# Altium schematic sheet Microcontroller.SchDoc: Microcontroller
size A4; SheetNumber: 4; SheetTotal: 13
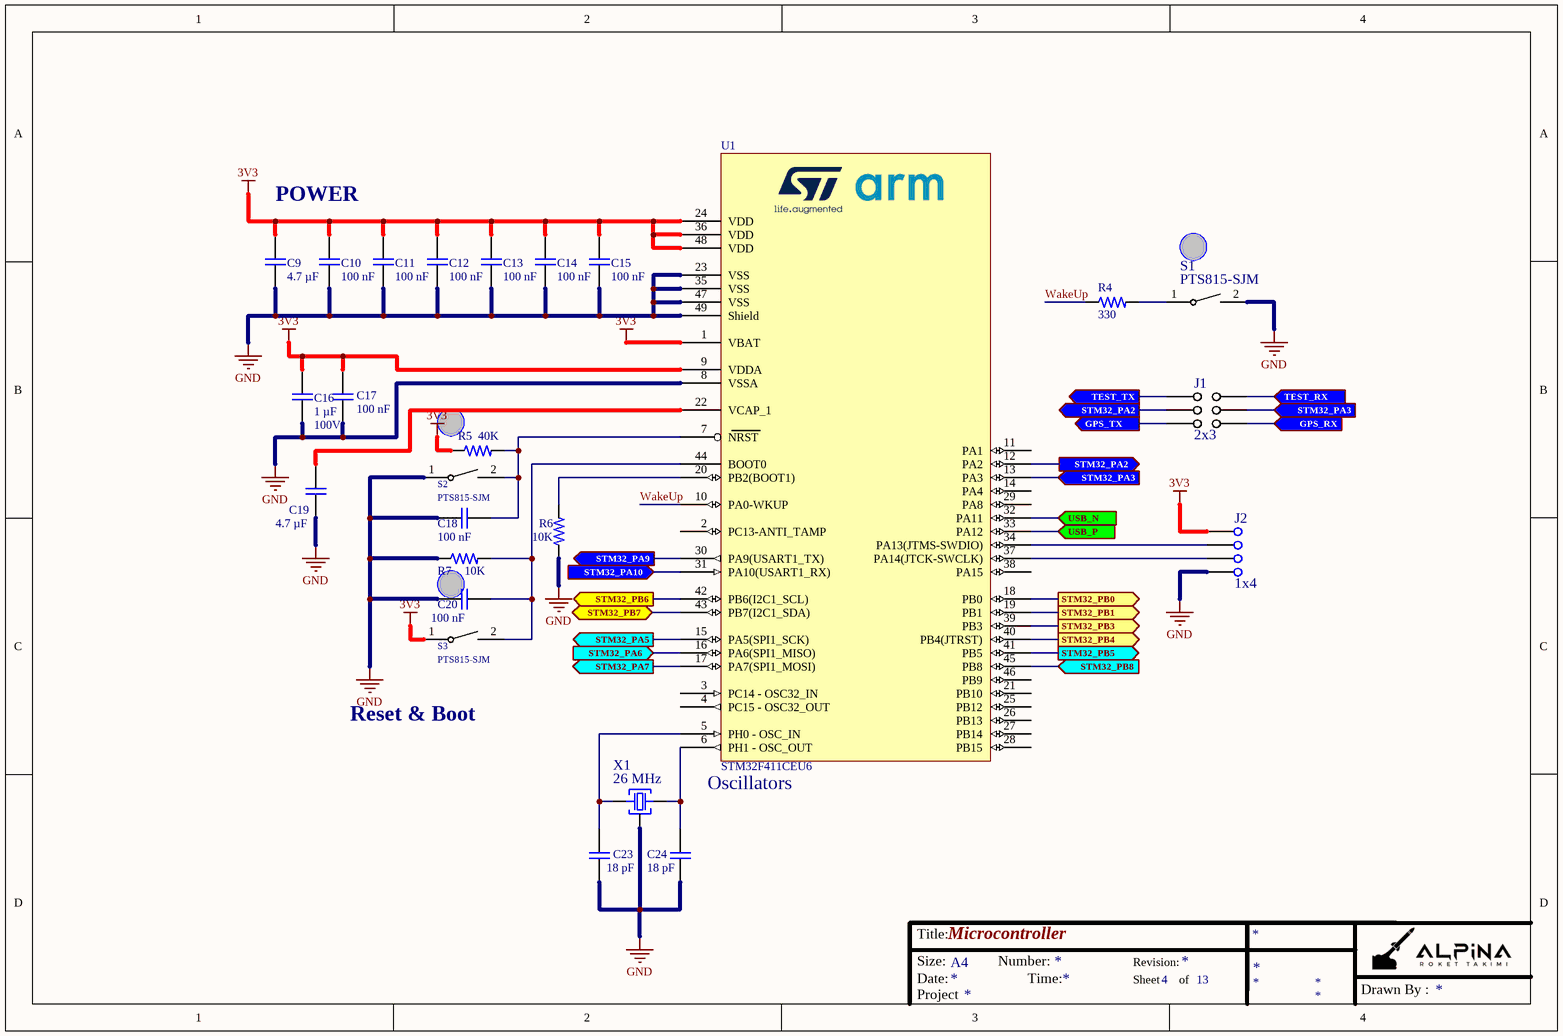
[diagram p0: Microcontroller.SchDoc]

## Parts
C9  4.7 µF  [MergenElektronik_Capacitors_Ceramics_SMDs_0603_M_NS]
C10  100 nF  [MergenElektronik_Capacitors_Ceramics_SMDs_0603_M_NS]
C11  100 nF  [MergenElektronik_Capacitors_Ceramics_SMDs_0603_M_NS]
C12  100 nF  [MergenElektronik_Capacitors_Ceramics_SMDs_0603_M_NS]
C13  100 nF  [MergenElektronik_Capacitors_Ceramics_SMDs_0603_M_NS]
C14  100 nF  [MergenElektronik_Capacitors_Ceramics_SMDs_0603_M_NS]
C15  100 nF  [MergenElektronik_Capacitors_Ceramics_SMDs_0603_M_NS]
C16  1 µF  Voltage Rating: 100V  [MergenElektronik_Capacitors_Ceramics_SMDs_1206_M_NS]
C17  100 nF  [MergenElektronik_Capacitors_Ceramics_SMDs_0603_M_NS]
C18  100 nF  [MergenElektronik_Capacitors_Ceramics_SMDs_0603_M_NS]
C19  4.7 µF  [MergenElektronik_Capacitors_Ceramics_SMDs_0603_M_NS]
C20  100 nF  [MergenElektronik_Capacitors_Ceramics_SMDs_0603_M_NS]
C23  18 pF  [MergenElektronik_Capacitors_Ceramics_SMDs_0603_M_NS]
C24  18 pF  [MergenElektronik_Capacitors_Ceramics_SMDs_0603_M_NS]
J1  2x3  [MergenElektronik_Connectors_Headers_2x3_Male]
J2  1x4  [MergenElektronik_Connectors_Headers_1x4_Male]
R4  330  [MergenElektronik_Resistors_ChipResistors_0603_M_NS]
R5  40K  [MergenElektronik_Resistors_ChipResistors_0603_M_NS]
R6  10K  [MergenElektronik_Resistors_ChipResistors_0603_M_NS]
R7  10K  [MergenElektronik_Resistors_ChipResistors_0603_M_NS]
S1  PTS815-SJM  [MergenElektronik_Switches_TactileSwitches_PTS815]
S2  PTS815-SJM  [MergenElektronik_Switches_TactileSwitches_PTS815]
S3  PTS815-SJM  [MergenElektronik_Switches_TactileSwitches_PTS815]
U1  STM32F411CEU6  [MergenElektronik_Microcontrollers_STMicroelectronics_UFQFPN-48]
X1  26 MHz  [MergenElektronik_Oscillators_Crystals_4-SMD]

## Ports
GPS_RX (in, see GPS[3B]), GPS_TX (out, see GPS[3B]), STM32_PA2 (out, see Microcontroller[3B]), STM32_PA3 (in, see Microcontroller[3B]), STM32_PA3 (in, see Microcontroller[4B]), STM32_PA5 (out, see SDCard[2C]), STM32_PA6 (in, see SDCard[2C]), STM32_PA7 (out, see SDCard[2C]), STM32_PA9 (out, see LoRa[3C]), STM32_PA10 (in, see LoRa[3B]), STM32_PB0 (out, see LoRa[3C]), STM32_PB1 (out, see LoRa[3C]), STM32_PB3 (out, see MOSFETs[2B]), STM32_PB4 (out, see MOSFETs[3B]), STM32_PB5 (out, see SDCard[2C]), STM32_PB6 (out, see Altimeter[3B], GPS[3B], Gyro[4B], PressureandTemperature[3B]), STM32_PB7 (bidir, see Altimeter[3B], GPS[3B], Gyro[4C], PressureandTemperature[3B]), STM32_PB8 (in, see SDCard[2C]), TEST_RX (in, see Test[3C]), TEST_TX (out, see Test[3C]), USB_N (in, see USB[4B]), USB_P (in, see USB[4B])

## Nets
3V3: C9.1 C10.1 C11.1 C12.1 C13.1 C14.1 C15.1 C16.1 C17.1 J2.4 R5.1 S3.1 U1.1(VBAT) U1.9(VDDA) U1.24(VDD) U1.36(VDD) U1.48(VDD)
GND: C9.2 C10.2 C11.2 C12.2 C13.2 C14.2 C15.2 C16.2 C17.2 C18.2 C19.2 C20.2 C23.2 C24.2 J2.1 R6.1 R7.1 S1.2 S2.1 U1.8(VSSA) U1.23(VSS) U1.35(VSS) U1.47(VSS) U1.49(Shield) X1.3
GPS_RX: J1.4 ; port GPS_RX
GPS_TX: J1.1 ; port GPS_TX
STM32_PA2: J1.2 U1.12(PA2) ; port STM32_PA2
STM32_PA3: J1.5 U1.13(PA3) ; port STM32_PA3
STM32_PA5: U1.15(PA5(SPI1_SCK)) ; port STM32_PA5
STM32_PA6: U1.16(PA6(SPI1_MISO)) ; port STM32_PA6
STM32_PA7: U1.17(PA7(SPI1_MOSI)) ; port STM32_PA7
STM32_PA9: U1.30(PA9(USART1_TX)) ; port STM32_PA9
STM32_PA10: U1.31(PA10(USART1_RX)) ; port STM32_PA10
STM32_PB0: U1.18(PB0) ; port STM32_PB0
STM32_PB1: U1.19(PB1) ; port STM32_PB1
STM32_PB3: U1.39(PB3) ; port STM32_PB3
STM32_PB4: U1.40(PB4(JTRST)) ; port STM32_PB4
STM32_PB5: U1.41(PB5) ; port STM32_PB5
STM32_PB6: U1.42(PB6(I2C1_SCL)) ; port STM32_PB6
STM32_PB7: U1.43(PB7(I2C1_SDA)) ; port STM32_PB7
STM32_PB8: U1.45(PB8) ; port STM32_PB8
TEST_RX: J1.6 ; port TEST_RX
TEST_TX: J1.3 ; port TEST_TX
USB_N: U1.32(PA11) ; port USB_N
USB_P: U1.33(PA12) ; port USB_P
WakeUp: R4.1 U1.10(PA0-WKUP)
NetC18_1: C18.1 R5.2 S2.2 U1.7(NRST)
NetC19_1: C19.1 U1.22(VCAP_1)
NetC20_1: C20.1 R7.2 S3.2 U1.44(BOOT0)
NetC23_1: C23.1 U1.5(PH0_-_OSC_IN) X1.1
NetC24_1: C24.1 U1.6(PH1_-_OSC_OUT) X1.2
NetJ2_2: J2.2 U1.37(PA14(JTCK-SWCLK))
NetJ2_3: J2.3 U1.34(PA13(JTMS-SWDIO))
NetR4_2: R4.2 S1.1
NetR6_2: R6.2 U1.20(PB2(BOOT1))

Not connected (* = marked no-connect by the designer): U1 2(PC13-ANTI_TAMP) 3(PC14_-_OSC32_IN) 4(PC15_-_OSC32_OUT) 11(PA1) 14(PA4) 21(PB10) 25(PB12) 26(PB13) 27(PB14) 28(PB15) 29(PA8) 38(PA15) 46(PB9)

## Notes on the sheet
- POWER
- Reset & Boot
- (near U1) Oscillators
- Title:
- Size:
- Date:
- A4
- Number:
- Time:
- Revision:
- Sheet
- of
- Project
- Drawn By :

## Library data of the parts
C9 C19 = MergenElektronik_Capacitors_Ceramic_SMDs_4.7µF_16V: Mergen Elektronik - Capacitors - Ceramics - SMDs - 0603 - 4.7 µF - 16V; Manufacturer: Samsung Electro-Mechanics; Manufacturer Number: CL10A475KO8NNNC; Model: Ceramic Capacitors; Tolerance: ±10%; Value: 4.7 µF; Temperature: -55°C up to +85°C; Digi-Key Number: 1276-1784-2-ND; Package: 0603(1608); Mouser Number: 187-CL10A475KO8NNNC; Mounting Type: Surface Mount; Supplier 1: Digi-Key; Supplier 2: Mouser; Supplier Part Number 1: 1276-1784-2-ND; Supplier Part Number 2: 187-CL10A475KO8NNNC; Özdisan Number: CL10A475KO8NNNC; Farnell Number: 3013397; Voltage Rating: 16V
C10-C15 C17 C18 C20 = MergenElektronik_Capacitors_Ceramic_SMDs_100nF_100V: Mergen Elektronik - Capacitors - Ceramics - SMDs - 0603 - 100 nF - 100V; Manufacturer: Samsung Electro-Mechanics; Manufacturer Number: CL10B104KC8NNNC; Model: Ceramic Capacitors; Tolerance: ±10%; Value: 100 nF; Temperature: -55°C up to +125°C; Digi-Key Number: 1276-6807-1-ND; Package: 0603(1608 Metric); Mouser Number: 187-CL10B104KC8NNNC; Mounting Type: Surface Mount; Farnell Number: 3013412; Özdisan Number: CL10B104KC8NNNC; Supplier 1: Digikey; Supplier 2: Mouser; Supplier Part Number 1: 1276-6807-1-ND; Supplier Part Number 2: 187-CL10B104KC8NNNC; Voltage Rating: 100V
C16 = MergenElektronik_Capacitors_Ceramic_SMDs_1µF_100V: Mergen Elektronik - Capacitors - Ceramics - SMDs - 1206 - 1 µF - 100V; Manufacturer: Samsung Electro-Mechanics; Manufacturer Number: CL31B105KCHNNNE; Model: Ceramic Capacitors; Tolerance: ±10%; Value: 1 µF; Temperature: -55°C up to +125°C; Digi-Key Number: 1276-1838-1-ND; Package: 1206(3216 Metric); Mouser Number: 187-CL31B105KCHNNNE; Mounting Type: Surface Mount; Özdisan Number: CL31B105KCHNNNE; Supplier 1: Digikey; Supplier 2: Mouser; Supplier Part Number 1: 1276-1838-1-ND; Supplier Part Number 2: 187-CL31B105KCHNNNE
C23 C24 = MergenElektronik_Capacitors_Ceramic_SMDs_18pF_50V: Mergen Elektronik - Capacitors - Ceramics - SMDs - 0603 - 18 pF - 50V; Manufacturer: YAGEO; Manufacturer Number: CC0603JRNPO9BN180; Model: Ceramic Capacitors; Tolerance: ±5%; Value: 18 pF; Temperature: -55°C up to +125°C; Digi-Key Number: 311-1061-1-ND; Package: 0603(1608); Farnell Number: 2408496; Mouser Number: 603-CC603JRNPO9BN180; Mounting Type: Surface Mount; Supplier 1: Mouser; Supplier 2: Digi-Key; Supplier Part Number 1: 603-CC603JRNPO9BN180; Supplier Part Number 2: 311-1061-6-ND; Voltage Rating: 50V
J1 = MergenElektronik_Connectors_Headers_2x3_Male: Mergen Elektronik - Connectors - Headers - 2x3 Male
J2 = MergenElektronik_Connectors_Headers_1x4_Male: Mergen Elektronik - Connectors - Headers - 1x4 Male
R4 = MergenElektronik_Resistors_ChipResistors_0603_330R: Mergen Elektronik - Resistors - Chip Resistors - 0603 - 330R; Manufacturer: Stackpole Electronics Inc; Manufacturer Number: RMCF0603JT330R; Value: Chip Resistor - 0603 - 330R; Power: 1/10W; Tolerance: ±5%; Package: 0603(1608); Temperature: -55°C up to +155°C - X8R; Model: Chip Resistor; Digi-Key Number: RMCF0603JT330RCT-ND; Mounting Type: Surface Mount; Supplier 1: Digi-Key; Supplier Part Number 1: RMCF0603JT330RCT-ND
R5 = MergenElektronik_Resistors_ChipResistors_0603_40K: Mergen Elektronik - Resistors - Chip Resistors - 0603 - 40K; Manufacturer: YAGEO; Manufacturer Number: RT0603BRD0740KL; Value: Chip Resistor - 0603 - 40K; Power: 1/10W; Tolerance: ±0.1%; Package: 0603(1608); Temperature: -55°C up to +155°C - X8R; Model: Chip Resistor; Digi-Key Number: 13-RT0603BRD0740KLTR-ND; Mounting Type: Surface Mount; Mouser Number: 603-RT0603BRD0740KL; Supplier 1: Digikey; Supplier 2: Mouser; Supplier Part Number 1: 13-RT0603BRD0740KLDKR-ND; Supplier Part Number 2: 603-RT0603BRD0740KL
R6 R7 = MergenElektronik_Resistors_ChipResistors_0603_10K: Mergen Elektronik - Resistors - Chip Resistors - 0603 - 10K; Manufacturer: Stackpole Electronics Inc; Manufacturer Number: RMCF0603JT10K0; Value: Chip Resistor - 0603 - 10K; Power: 1/10W; Tolerance: ±5%; Package: 0603(1608); Temperature: -55°C up to +155°C - X8R; Model: Chip Resistor; Digi-Key Number: RMCF0603JT10K0CT-ND; Mounting Type: Surface Mount; Supplier 1: Digi-Key; Supplier Part Number 1: RMCF0603JT10K0-ND
S1-S3 = MergenElektronik_Switches_TactileSwitches_PTS815-SJM: Mergen Elektronik - Switches - Tactile  Switches; Manufacturer Number: PTS815 SJM 250 SMTR LFS; Manufacturer: C&K; Current Rating: 50mA; Voltage Rating: 12VDC; Digi-Key Number: CKN12215-1-ND; Model: Tactile Switches; Mounting Type: Surface Mount; Package: PTS815; Temperature: -20°C up to +70°C; Value: PTS815-SJM; Mouser Number: 611-PTS815SJM250SMTR; Farnell Number: 3780619; Supplier 1: Mouser; Supplier 2: Digi-Key; Supplier Part Number 1: 611-PTS815SJM250SMTR; Supplier Part Number 2: CKN12215-6-ND
U1 = MergenElektronik_Microcontrollers_STMicroelectronics_STM32F411CEU6: Mergen Elektronik - Microcontrollers - STMicroelectronics - STM32F411CEU6; Model: ARM® Cortex®-M4 Microcontroller; Operating Supply Voltage: 1.7V up to 3.6V; Number of I/O: 36; Speed: 100MHz with PLL; Core Size: 32-Bit; Memory Size: 512kB; Ram Size: 128K x 8; Digi-Key Number: 497-14907-ND; Manufacturer: STMicroelectronics; Manufacturer Number: STM32F411CEU6; Mounting Type: Surface Mount; Mouser Number: 511-STM32F411CEU6; Package: UFQFPN-48; Temperature: -40°C up to 85°C (TA); Value: STM32F411CEU6; Farnell Number: 3365489; Supplier 1: Digikey; Supplier 2: Mouser; Supplier Part Number 1: 497-14907-ND; Supplier Part Number 2: 511-STM32F411CEU6
X1 = MergenElektronik_Oscillators_Crystals_4_SMD_26MHz: Mergen Elektronik - Oscilators - Crystals - 4-SMD - 26 MHz; Manufacturer: TXC CORPORATION; Manufacturer Number: 7M-26.000MAAJ-T; Model: Crystal Oscilator; Load Capacitance: 18 pF; Digi-Key Number: 887-1133-2-ND; Mounting Type: Surface Mount; Frequency: 26 MHz; Package: 4-SMD; Temperature: -20°C up to 70°C; Value: 26 MHz; Supplier 1: Digi-Key; Supplier Part Number 1: 2151-RH100-12.000-18-2030-TRCT-ND; Supplier Part Number 2: 717-7M-26.000MAAJ-T; Supplier 2: Mouser; Farnell Number: 1842069; Mouser Number: 717-7M-26.000MAAJ-T